# Altium project PCB_Project.PrjPcb
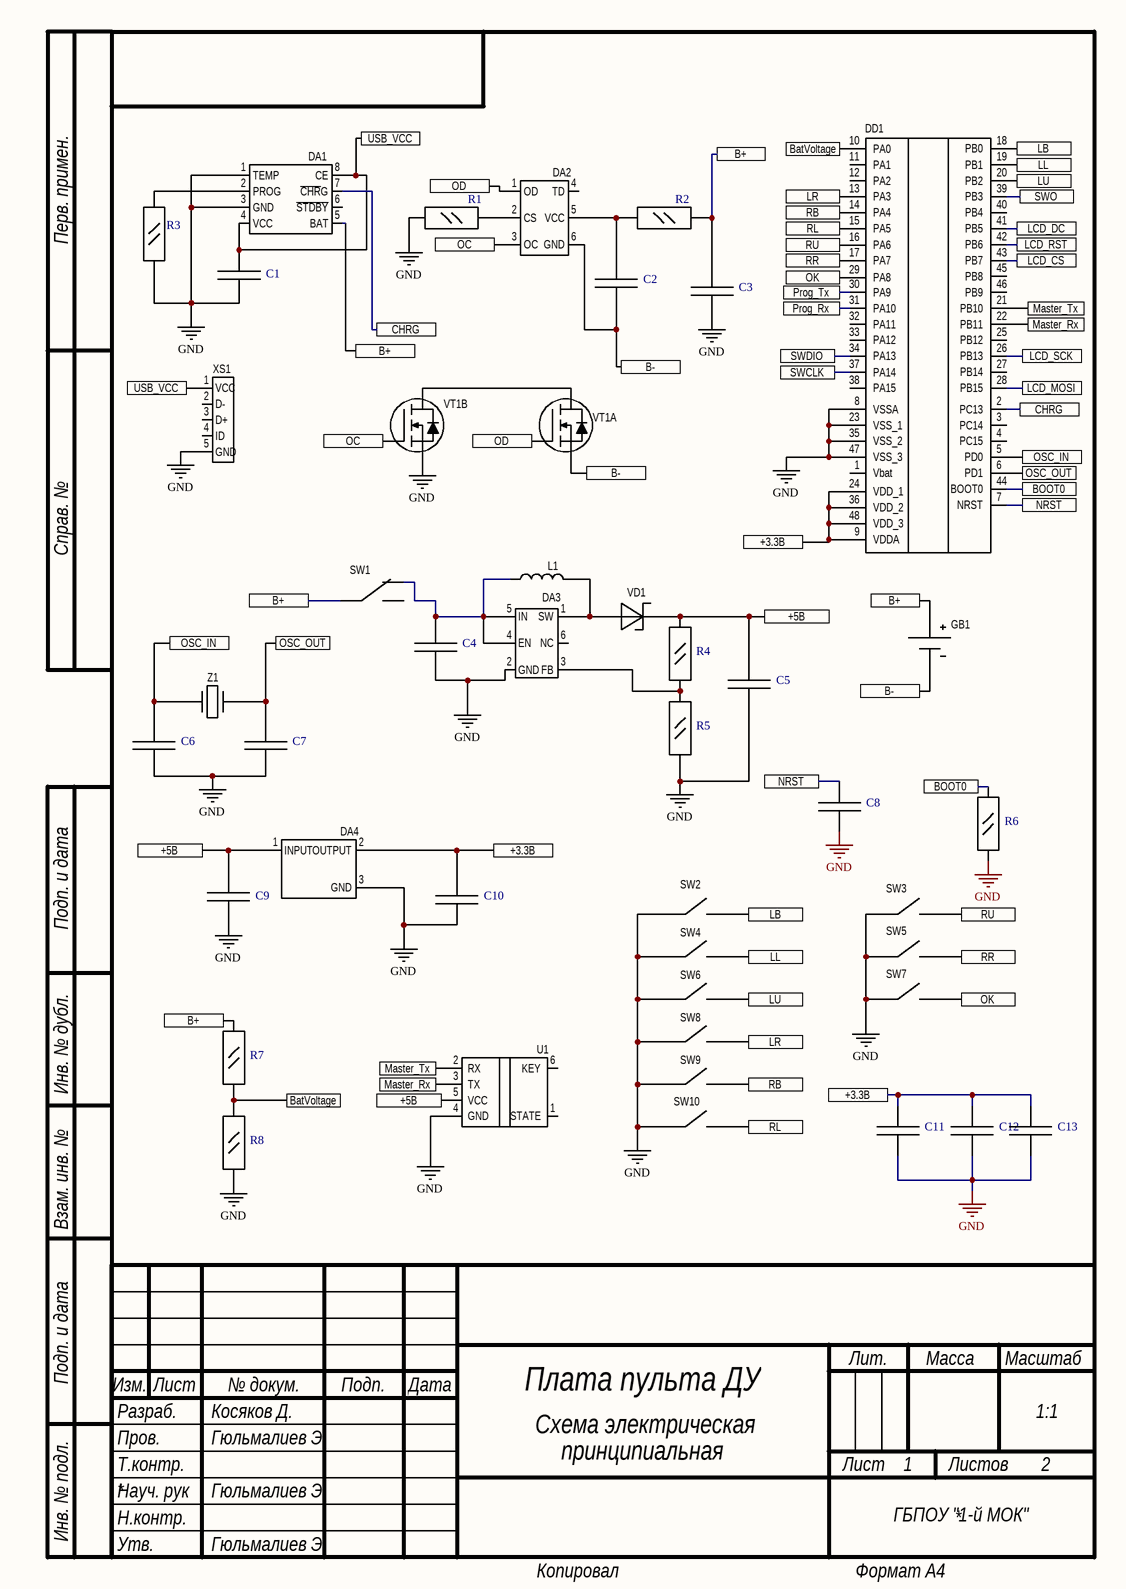
[diagram p0: Sheet3.SchDoc]
2 sheets, 46 parts. Net scope: flat (ports and power ports of the same name join across sheets).
Board file: PCB1.PcbDoc
Sheets:
  Sheet3.SchDoc
  Sheet1.SchDoc

## Sheet Sheet3.SchDoc
size 209 x 297 mm; Scale: 1:1; Номер листа: 1; Общее количество листов: 2; Разраб.: Косяков Д.; Пров.: Гюльмалиев Э.; Утв.: Гюльмалиев Э.; Масштаб: 1:1; Наименование организации: ГБПОУ "1-й МОК"; Наименование изделия 1: Плата пульта ДУ; Наименование изделия 2: Схема электрическая; Наименование изделия 3: принципиальная; Нач. отд.: Науч. рук; Фамилия нач. отд.: Гюльмалиев Э.

### Parts
C1  0.1uF  [CAPC2112X13N]  (value not drawn)
C2  0.1uF  [CAPC2112X13N]  (value not drawn)
C3  10uF  [CAPC2112X13N]  (value not drawn)
C4  22uF  [CAPC2112X13N]  (value not drawn)
C5  22uF  [CAPC2112X13N]  (value not drawn)
C6  22pF  [CAPC2112X13N]  (value not drawn)
C7  22pF  [CAPC2112X13N]  (value not drawn)
C8  0.1uF  [CAPC2112X13N]  (value not drawn)
C9  10uF  [CAPC2112X13N]  (value not drawn)
C10  10uF  [CAPC2112X13N]  (value not drawn)
C11  0.1uF  [CAPC2112X13N]  (value not drawn)
C12  0.1uF  [CAPC2112X13N]  (value not drawn)
C13  0.1uF  [CAPC2112X13N]  (value not drawn)
DA1  TP4056  [SOP127P600X173-8N]  (value not drawn)
DA2  DA?  [SOT-23-6]  (value not drawn)
DA3  MT3608  [SOT-23-6]  (value not drawn)
DA4  NCP1117  [SOT230P700X180-4N]  (value not drawn)
DD1  STM32F103C8T6 (LQFP48)  [TSQFP50P900X900X160-48N]  (value not drawn)
GB1  Batt Li-On  [BATT]  (value not drawn)
L1  22uH  [inductor SMD]  (value not drawn)
R1  1k  [RESC2113X06N]  (value not drawn)
R2  100  [RESC2113X06N]  (value not drawn)
R3  1.2k  [RESC2113X06N]  (value not drawn)
R4  15k  [RESC2113X06N]  (value not drawn)
R5  2k  [RESC2113X06N]  (value not drawn)
R6  100k  [RESC2113X06N]  (value not drawn)
R7  47k  [RESC2113X06N]  (value not drawn)
R8  47k  [RESC2113X06N]  (value not drawn)
SW1  SWITCH  [Switch]  (value not drawn)
SW2  Button  [PCBComponent_1]  (value not drawn)
SW3  Button  [PCBComponent_1]  (value not drawn)
SW4  Button  [PCBComponent_1]  (value not drawn)
SW5  Button  [PCBComponent_1]  (value not drawn)
SW6  Button  [PCBComponent_1]  (value not drawn)
SW7  Button  [PCBComponent_1]  (value not drawn)
SW8  Button  [PCBComponent_1]  (value not drawn)
SW9  Button  [PCBComponent_1]  (value not drawn)
SW10  Button  [PCBComponent_1]  (value not drawn)
U1  HC-05  [HC-05]  (value not drawn)
VD1  SS34  [SS34]  (value not drawn)
VT1  FS8205A(MOSFET,TSSOP-8)  [TSOP65P600X120-8N]  (value not drawn)  (parts A,B of 2)
XS1  USB  [USB_Type2]  (value not drawn)
Z1  Quartz  [HC-49SM]  (value not drawn)

### Ports
+3.3В, +5В, B+, B-, BatVoltage, BOOT0, CHRG, LB, LCD_CS, LCD_DC, LCD_MOSI, LCD_RST, LCD_SCK, LL, LR, LU, Master_Rx, Master_Tx, NRST, OC, OD, OK, OSC_IN, OSC_OUT, Prog_Rx, Prog_Tx, RB, RL, RR, RU, SWCLK, SWDIO, SWO, USB_VCC

### Nets
GND: C1.1 C3.1 C4.1 C5.1 C6.1 C7.1 C8.1 C9.1 C10.1 C11.1 C12.1 C13.1 DA1.1(TEMP) DA1.3(GND) DA3.2(GND) DA4.3(GND) DD1.8(VSSA) DD1.23(VSS_1) DD1.35(VSS_2) DD1.47(VSS_3) R1.2 R3.1 R5.1 R6.1 R8.1 SW2.1 SW3.1 SW4.1 SW5.1 SW6.1 SW7.1 SW8.1 SW9.1 SW10.1 U1.4(GND) VT1.6(S2) XS1.5(GND)
NetC1_2: C1.2 DA1.4(VCC) DA1.8(CE) XS1.1(VCC) ; port USB_VCC
NetC2_1: C2.1 DA2.6(GND) GB1.2 VT1.2(S1) ; port B-
NetC2_2: C2.2 DA2.5(VCC) R2.2
NetC3_2: C3.2 DA1.5(BAT) GB1.1 R2.1 R7.2 SW1.1 ; port B+
NetC4_2: C4.2 DA3.4(EN) DA3.5(IN) L1.1 SW1.2
NetC5_2: C5.2 C9.2 DA4.1(INPUT) R4.2 U1.5(VCC) VD1.2 ; port +5В
NetC6_2: C6.2 DD1.5(PD0) Z1.1 ; port OSC_IN
NetC7_2: C7.2 DD1.6(PD1) Z1.2 ; port OSC_OUT
NetC8_2: C8.2 DD1.7(NRST) ; port NRST
NetC10_2: C10.2 C11.2 C12.2 C13.2 DA4.2(OUTPUT) DD1.9(VDDA) DD1.24(VDD_1) DD1.36(VDD_2) DD1.48(VDD_3) ; port +3.3В
NetDA1_2: DA1.2(PROG) R3.2
NetDA1_7: DA1.7(~{CHR}G) DD1.2(PC13) ; port CHRG
NetDA2_1: DA2.1(OD) VT1.4(G1) ; port OD
NetDA2_2: DA2.2(CS) R1.1
NetDA2_3: DA2.3(OC) VT1.5(G2) ; port OC
NetDA3_1: DA3.1(SW) L1.2 VD1.1
NetDA3_3: DA3.3(FB) R4.1 R5.2
NetDD1_10: DD1.10(PA0) R7.1 R8.2 ; port BatVoltage
NetDD1_13: DD1.13(PA3) SW8.2 ; port LR
NetDD1_14: DD1.14(PA4) SW9.2 ; port RB
NetDD1_15: DD1.15(PA5) SW10.2 ; port RL
NetDD1_16: DD1.16(PA6) SW3.2 ; port RU
NetDD1_17: DD1.17(PA7) SW5.2 ; port RR
NetDD1_18: DD1.18(PB0) SW2.2 ; port LB
NetDD1_19: DD1.19(PB1) SW4.2 ; port LL
NetDD1_20: DD1.20(PB2) SW6.2 ; port LU
NetDD1_21: DD1.21(PB10) U1.2(RX) ; port Master_Tx
NetDD1_22: DD1.22(PB11) U1.3(TX) ; port Master_Rx
NetDD1_26: DD1.26(PB13) ; port LCD_SCK
NetDD1_28: DD1.28(PB15) ; port LCD_MOSI
NetDD1_29: DD1.29(PA8) SW7.2 ; port OK
NetDD1_30: DD1.30(PA9) ; port Prog_Tx
NetDD1_31: DD1.31(PA10) ; port Prog_Rx
NetDD1_34: DD1.34(PA13) ; port SWDIO
NetDD1_37: DD1.37(PA14) ; port SWCLK
NetDD1_39: DD1.39(PB3) ; port SWO
NetDD1_41: DD1.41(PB5) ; port LCD_DC
NetDD1_42: DD1.42(PB6) ; port LCD_RST
NetDD1_43: DD1.43(PB7) ; port LCD_CS
NetDD1_44: DD1.44(BOOT0) R6.2 ; port BOOT0
NetVT1_1: VT1.1(D12) VT1.8(D12)

Not connected (* = marked no-connect by the designer): DA1 6(~{STDBY}); DA2 4(TD); DA3 6(NC); DD1 1(Vbat) 3(PC14) 4(PC15) 11(PA1) 12(PA2) 25(PB12) 27(PB14) 32(PA11) 33(PA12) 38(PA15) 40(PB4) 45(PB8) 46(PB9); SW1 3; U1 1(STATE) 6(KEY); XS1 2(D-) 3(D+) 4(ID)

### Notes on the sheet
- Перв. примен.
- Справ. №
- Подп. и дата
- Инв. № дубл.
- Взам. инв. №
- Разраб.
- Изм.
- Лист
- № докум.
- Подп.
- Дата
- Лит.
- Масса
- Масштаб
- Пров.
- Т.контр.
- Листов
- Инв. № подл.
- Утв.
- Н.контр.
- Копировал
- Формат А4

### Library data of the parts
C3-C7 C9 C10 = 0.1uF
DA2 = DW01A
DA3 = MT3608: DC-DC Up converter (SOT23-6)
L1 = Inductor
R1-R8 = Резистор 0805
VD1 = SS34: Диод Шоттки 3A 40V
VT1 = FS8205A(MOSFET,TSSOP-8): N-Channel MOSFET TSSOP-8

## Sheet Sheet1.SchDoc
size 209 x 297 mm; Scale: 1:1; Разраб.: Косяков Д.; Пров.: Гюльмалиев Э.; Утв.: Гюльмалиев Э.; Номер листа: 2; Общее количество листов: 2; Наименование организации: ГБПОУ "1-й МОК"; Наименование изделия 1: Плата; Наименование изделия 2: Схема электрическая; Наименование изделия 3: принципиальная; Нач. отд.: Науч.рук; Фамилия нач. отд.: Гюльмалиев Э.
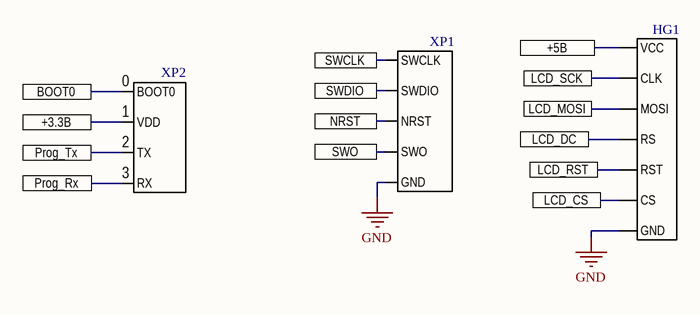
[diagram p1: Sheet1.SchDoc]

### Parts
HG1  TFT_SPI  [LCD_TFT_SPI]  (value not drawn)
XP1  SWD  [SWD]  (value not drawn)
XP2  UART  [UART]  (value not drawn)

### Ports
+3.3В, +5В, BOOT0, LCD_CS, LCD_DC, LCD_MOSI, LCD_RST, LCD_SCK, NRST, Prog_Rx, Prog_Tx, SWCLK, SWDIO, SWO

### Nets
GND: HG1.2(GND) XP1.1(GND)
NetC5_2: HG1.1(VCC) ; port +5В
NetC8_2: XP1.3(NRST) ; port NRST
NetC10_2: XP2.1(VDD) ; port +3.3В
NetDD1_26: HG1.3(CLK) ; port LCD_SCK
NetDD1_28: HG1.4(MOSI) ; port LCD_MOSI
NetDD1_30: XP2.2(TX) ; port Prog_Tx
NetDD1_31: XP2.3(RX) ; port Prog_Rx
NetDD1_34: XP1.2(SWDIO) ; port SWDIO
NetDD1_37: XP1.0(SWCLK) ; port SWCLK
NetDD1_39: XP1.4(SWO) ; port SWO
NetDD1_41: HG1.5(RS) ; port LCD_DC
NetDD1_42: HG1.6(RST) ; port LCD_RST
NetDD1_43: HG1.7(CS) ; port LCD_CS
NetDD1_44: XP2.0(BOOT0) ; port BOOT0

### Notes on the sheet
- Перв. примен.
- Справ. №
- Подп. и дата
- Инв. № дубл.
- Взам. инв. №
- Разраб.
- Изм.
- Лист
- № докум.
- Подп.
- Дата
- Лит.
- Масса
- Масштаб
- Пров.
- Т.контр.
- Листов
- Инв. № подл.
- Утв.
- Н.контр.
- Копировал
- Формат А4

## Nets that join several sheets
GND: Sheet3 (37 pins), Sheet1 (HG1.2 XP1.1)
NetC5_2: Sheet3 (6 pins), Sheet1 (HG1.1)
NetC8_2: Sheet3 (C8.2 DD1.7), Sheet1 (XP1.3)
NetC10_2: Sheet3 (9 pins), Sheet1 (XP2.1)
NetDD1_26: Sheet3 (DD1.26), Sheet1 (HG1.3)
NetDD1_28: Sheet3 (DD1.28), Sheet1 (HG1.4)
NetDD1_30: Sheet3 (DD1.30), Sheet1 (XP2.2)
NetDD1_31: Sheet3 (DD1.31), Sheet1 (XP2.3)
NetDD1_34: Sheet3 (DD1.34), Sheet1 (XP1.2)
NetDD1_37: Sheet3 (DD1.37), Sheet1 (XP1.0)
NetDD1_39: Sheet3 (DD1.39), Sheet1 (XP1.4)
NetDD1_41: Sheet3 (DD1.41), Sheet1 (HG1.5)
NetDD1_42: Sheet3 (DD1.42), Sheet1 (HG1.6)
NetDD1_43: Sheet3 (DD1.43), Sheet1 (HG1.7)
NetDD1_44: Sheet3 (DD1.44 R6.2), Sheet1 (XP2.0)